# Altium project Multivibrator.PrjPcb
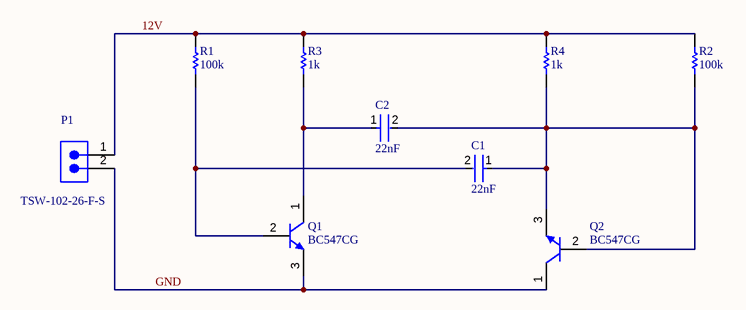
[diagram p0: Multivibrator.SchDoc]
1 sheet, 9 parts. Net scope: global (net labels, ports and power ports of the same name join across sheets).
Board file: Multivibrator.PcbDoc

## Sheet Multivibrator.SchDoc
size 431 x 279 mm; SheetNumber: 1; SheetTotal: 1; ENG_APP_DATE: --/--/--; DSN_APP_DATE: --/--/--; CHK_APP_DATE: --/--/--

### Parts
C1  value 22nF  [FP-C0603C-CF-IPC_A]  (hidden comment: Capacitor 22nF +/-5% 16V 0603)
C2  value 22nF  [FP-C0603C-CF-IPC_A]  (hidden comment: Capacitor 22nF +/-5% 16V 0603)
P1  TSW-102-26-F-S  [SMTC-TSW-102-26-XX-S]
Q1  BC547CG  [ONSC-TO-92-3-29-11]
Q2  BC547CG  [ONSC-TO-92-3-29-11]
R1  value 100k  [RESC2013X70X40ML20T20]  (hidden comment: Resistor 100K +/-5% 0805 125 mW)
R2  value 100k  [RESC2013X70X40ML20T20]  (hidden comment: Resistor 100K +/-5% 0805 125 mW)
R3  value 1k  [RESC2013X70X40ML20T20]  (hidden comment: Resistor 1K +/-5% 0805 500 mW)
R4  value 1k  [RESC2013X70X40ML20T20]  (hidden comment: Resistor 1K +/-5% 0805 500 mW)

### Nets
12V: P1.1 R1.2 R2.2 R3.2 R4.2
GND: P1.2 Q1.3(E) Q2.1(C)
NetC1_1: C1.1 C2.2 Q2.2(B) Q2.3(E) R2.1 R4.1
NetC1_2: C1.2 Q1.2(B) R1.1
NetC2_1: C2.1 Q1.1(C) R3.1

### Notes on the sheet
- DWG. NO.
- REV.
- SHT.
- THIS DOCUMENT AND THE DATA DISCLOSED HEREIN OR HEREWITH IS THE PROPERTY OF ALTIUM LIMITED AND MAY BE FREELY DISTRIBUTED IN WHOLE. NO RIGHTS ARE RESERVED OR EXPRESS OR IMPLIED WARANTEE GIVEN.
- REVISION
- DESCRIPTION
- DATE
- APPROVED
- ENG:
- APPROVALS
- PROJECT
- DSN:
- CHK:
- REFERENCE DOCUMENTS
- PROJECT REVISION:
- TITLE
- DOCUMENT REVISION:
- DESIGN ITEM:
- BOM:
- FAB DWG:
- PCB DWG:
- ASSY DWG:
- SCALE:
- SIZE
- B
- CAGE CODE
- FILE NAME
- DWG NO.
- SHEET
- OF
- REV

### Library data of the parts
C1 C2 = CMP-001-00084-1: Ceramic Capacitor, Multilayer, Ceramic, 16V, 5% +Tol, 5% -Tol, X7R, 15% TC, 0.022uF, Surface Mount, 0603; Capacitor Type: Ceramic; Max Operating Temperature: 125°C; Min Operating Temperature: -55°C; Pins: 2; Case/Package: 0603; RoHS Compliant: Yes; Mounting Technology: Surface Mount
P1 = CMP-002-00072-1: Board Connector, 2 Contact(s), 1 Row(s), Male, Straight, 0.1 inch Pitch, Solder Terminal, Black Insulator; RoHS Compliant: Yes; Mounting Technology: Board; Connector Type: BOARD CONNECTOR
Q1 Q2 = CMP-013-00034-1: Small Signal Bipolar Transistor, 0.1A I(C), 45V V(BR)CEO, 1-Element, NPN, Silicon, TO-92; Frequency: 300MHz; Max Operating Temperature: 150°C; Pins: 3; RoHS Compliant: Yes
R1 R2 = CMP-009-00178-1: Fixed Resistor, Metal Glaze/thick Film, 0.125W, 100000ohm, 150V, 5% +/-Tol, 200ppm/Cel, Surface Mount, 0805; Power: 125mW; Min Operating Temperature: -55°C; Pins: 2; RoHS Compliant: Yes; Tolerance: 5%; Mounting Technology: Surface Mount; Case/Package: 0805; Max Operating Temperature: 155°C
R3 R4 = CMP-009-00179-1: Fixed Resistor, Metal Glaze/thick Film, 0.125W, 1000ohm, 150V, 5% +/-Tol, 200ppm/Cel, Surface Mount, 0805; Power: 125mW; RoHS Compliant: Yes; Max Operating Temperature: 155°C; Case/Package: 0805; Min Operating Temperature: -55°C; Tolerance: 5%; Mounting Technology: Surface Mount; Pins: 2